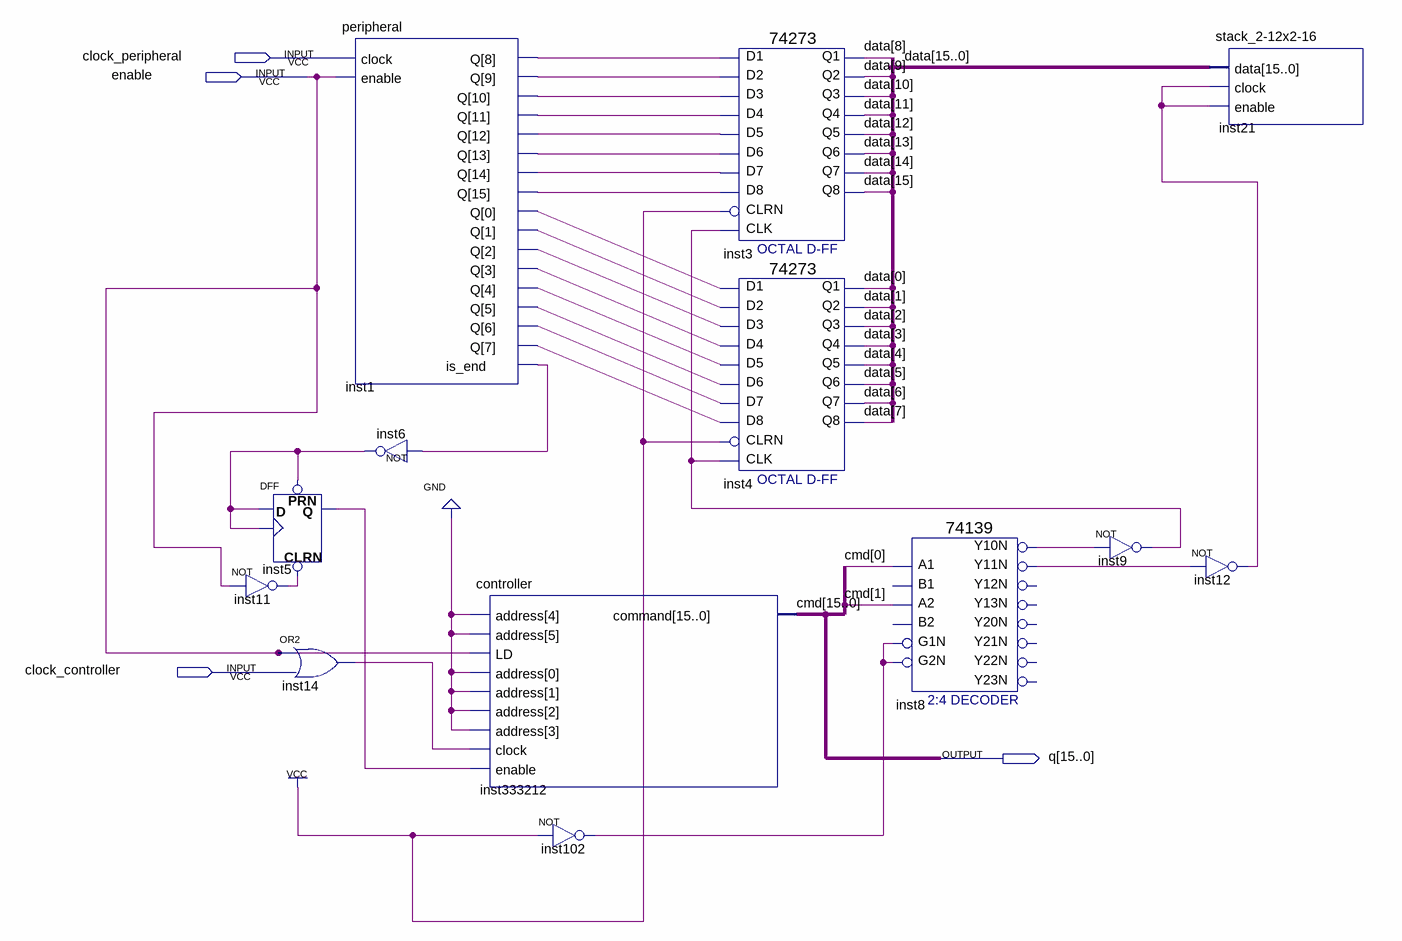
[diagram p0: schematic sheet]
// Quartus schematic DMAMethod.bdf as structural Verilog: 13 symbols, 4 pins
module DMAMethod (
  input  clock_peripheral,
  input  enable,
  input  clock_controller,
  output [15:0] q
);

  wire inst1_is_end, inst1_q, inst1_q_2, inst1_q_3, inst1_q_4, inst1_q_5, inst1_q_6, inst1_q_7, inst1_q_8,
       inst1_q_9, inst1_q_10, inst1_q_11, inst1_q_12, inst1_q_13, inst1_q_14, inst1_q_15, inst1_q_16,
       inst5_q, inst6_out, inst8_y10n, inst8_y11n, inst9_out, inst11_out, inst12_out, inst14_out, inst102_out;
  wire [15:0] data;

  DFF inst5 (.CLRN(inst11_out), .CLK(inst6_out), .D(inst6_out), .PRN(inst6_out), .Q(inst5_q));
  not inst11 (inst11_out, enable);
  peripheral inst1 (
    .clock(clock_peripheral), .enable(enable),
    .Q({inst1_q_8, inst1_q_7, inst1_q_6, inst1_q_5, inst1_q_4, inst1_q_3, inst1_q_2, inst1_q, inst1_q_16, inst1_q_15, inst1_q_14, inst1_q_13, inst1_q_12, inst1_q_11, inst1_q_10, inst1_q_9}),
    .is_end(inst1_is_end));
  or inst14 (inst14_out, enable, clock_controller);
  not inst6 (inst6_out, inst1_is_end);
  controller inst333212 (.address({6{1'b0}}), .LD(enable), .clock(inst14_out), .enable(inst5_q), .command(q));
  not inst102 (inst102_out, 1'b1);
  \74273  inst3 (
    .D2(inst1_q_2), .D3(inst1_q_3), .D1(inst1_q), .D4(inst1_q_4), .D7(inst1_q_7), .D6(inst1_q_6),
    .D5(inst1_q_5), .D8(inst1_q_8), .CLK(inst9_out), .CLRN(1'b1), .Q4(data[11]), .Q1(data[8]), .Q2(data[9]),
    .Q3(data[10]), .Q6(data[13]), .Q5(data[12]), .Q7(data[14]), .Q8(data[15]));
  \74273  inst4 (
    .D2(inst1_q_10), .D3(inst1_q_11), .D1(inst1_q_9), .D4(inst1_q_12), .D7(inst1_q_15), .D6(inst1_q_14),
    .D5(inst1_q_13), .D8(inst1_q_16), .CLK(inst9_out), .CLRN(1'b1), .Q4(data[3]), .Q1(data[0]), .Q2(data[1]),
    .Q3(data[2]), .Q6(data[5]), .Q5(data[4]), .Q7(data[6]), .Q8(data[7]));
  \74139  inst8 (
    .A1(q[0]), .A2(q[1]), .G1N(inst102_out), .G2N(inst102_out), .Y10N(inst8_y10n), .Y11N(inst8_y11n));  // open: B1, B2, Y20N, Y13N, Y12N, Y21N, Y22N, Y23N
  not inst9 (inst9_out, inst8_y10n);
  not inst12 (inst12_out, inst8_y11n);
  \stack_2-12x2-16  inst21 (.data(data), .clock(inst12_out), .enable(inst12_out));

  // Other names for the same wires on the sheet: cmd[15:0] = q
endmodule
